# Altium schematic sheet MES.SchDoc
size A
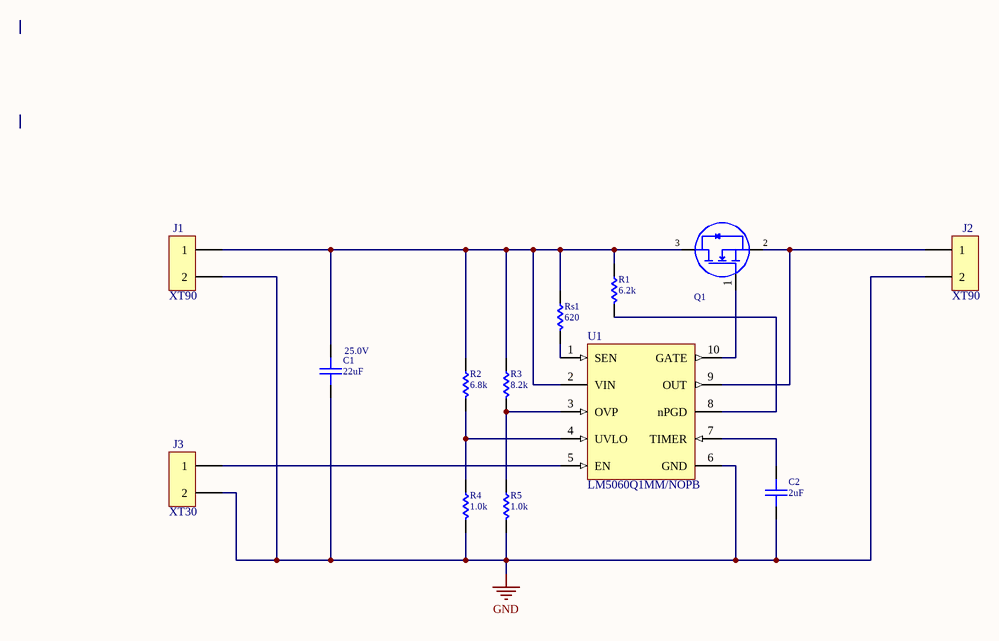
[diagram p0: MES.SchDoc]

## Parts
C1  Capacitance: 22uF  Voltage: 25.0V  [Component 0805]  (hidden comment: Ceramic Capacitor)
C2  Capacitance: 2uF  [Component 0805]  (hidden comment: Ceramic Capacitor)
J1  TYPE: XT90  (hidden comment: Connector, XT90)
J2  TYPE: XT90  (hidden comment: Connector, XT90)
J3  TYPE: XT30  (hidden comment: Connector, XT90)
Q1  IXFN360N10T  [IXFN360N10T]  (value not drawn)
R1  Resistance: 6.2k  [Component 0805]  (hidden comment: Resistor)
R2  Resistance: 6.8k  [Component 0805]  (hidden comment: Resistor)
R3  Resistance: 8.2k  [Component 0805]  (hidden comment: Resistor)
R4  Resistance: 1.0k  [Component 0805]  (hidden comment: Resistor)
R5  Resistance: 1.0k  [Component 0805]  (hidden comment: Resistor)
Rs1  Resistance: 620  [Component 0805]  (hidden comment: Resistor)
U1  LM5060Q1MM/NOPB  [MUB10A_N]

## Nets
GND: C1.2 C2.2 J1.2 J2.2 J3.2 R4.2 R5.2 U1.6(GND)
NetC1_1: C1.1 J1.1 Q1.3(Drain) R1.1 R2.1 R3.1 Rs1.1 U1.2(VIN)
NetC2_1: C2.1 U1.7(TIMER)
NetJ2_1: J2.1 Q1.2(Source) U1.9(OUT)
NetJ3_1: J3.1 U1.5(EN)
NetQ1_1: Q1.1(Gate) U1.10(GATE)
NetR1_2: R1.2 U1.8(nPGD)
NetR2_2: R2.2 R4.1 U1.4(UVLO)
NetR3_2: R3.2 R5.1 U1.3(OVP)
NetRs1_2: Rs1.2 U1.1(SEN)

## Library data of the parts
C1 C2 = Capacitor, Ceramic: *
Q1 = IXFN360N10T: N-Channel MOSFET 830W
R1-R5 Rs1 = Resistor: Thick Film Resistors - SMD 1/16watt 1%
U1 = LM5060Q1MM/NOPB: High-Side Protection Controller with Low Quiescent Current, 10-pin MSOP, Pb-Free; Manufacturer: National Semiconductor; PackageTopMarking: ZXTT*SZAB; High-Reliability: Y; CompType: Switcher; ComponentLink4Description: MUB10A Package Page; PartNumber: LM5060Q1MM/NOPB; ComponentLink1Description: Manufacturer URL; ComponentLink2Description: LM5060 Datasheet; DatasheetVersion: Dec-2010; ComponentLink3URL: http://www.national.com/pf/LM/LM5060.html; ComponentLink1URL: http://www.national.com/; Code_JEDEC: MO-187-BA; RevisionNote: PowerWise parameter updated.; ComponentLink4URL: http://www.national.com/packaging/folders/mub10a.html; PackageReference: MUB10A; ComponentLink3Description: LM5060 Web Page; PackageVersion: revB, Jul-2003; RoHS: Y; PinCount: 10; ComponentLink2URL: http://www.national.com/ds/LM/LM5060.pdf; PowerWise: Y; PackageDescription: Mini-SO, Molded, .118 x .118 x .034in Body, 10 Lead, .0197in Pitch